# EAGLE design ZED-F9P GNSS FeatherWing (EAGLE 9.4.1)
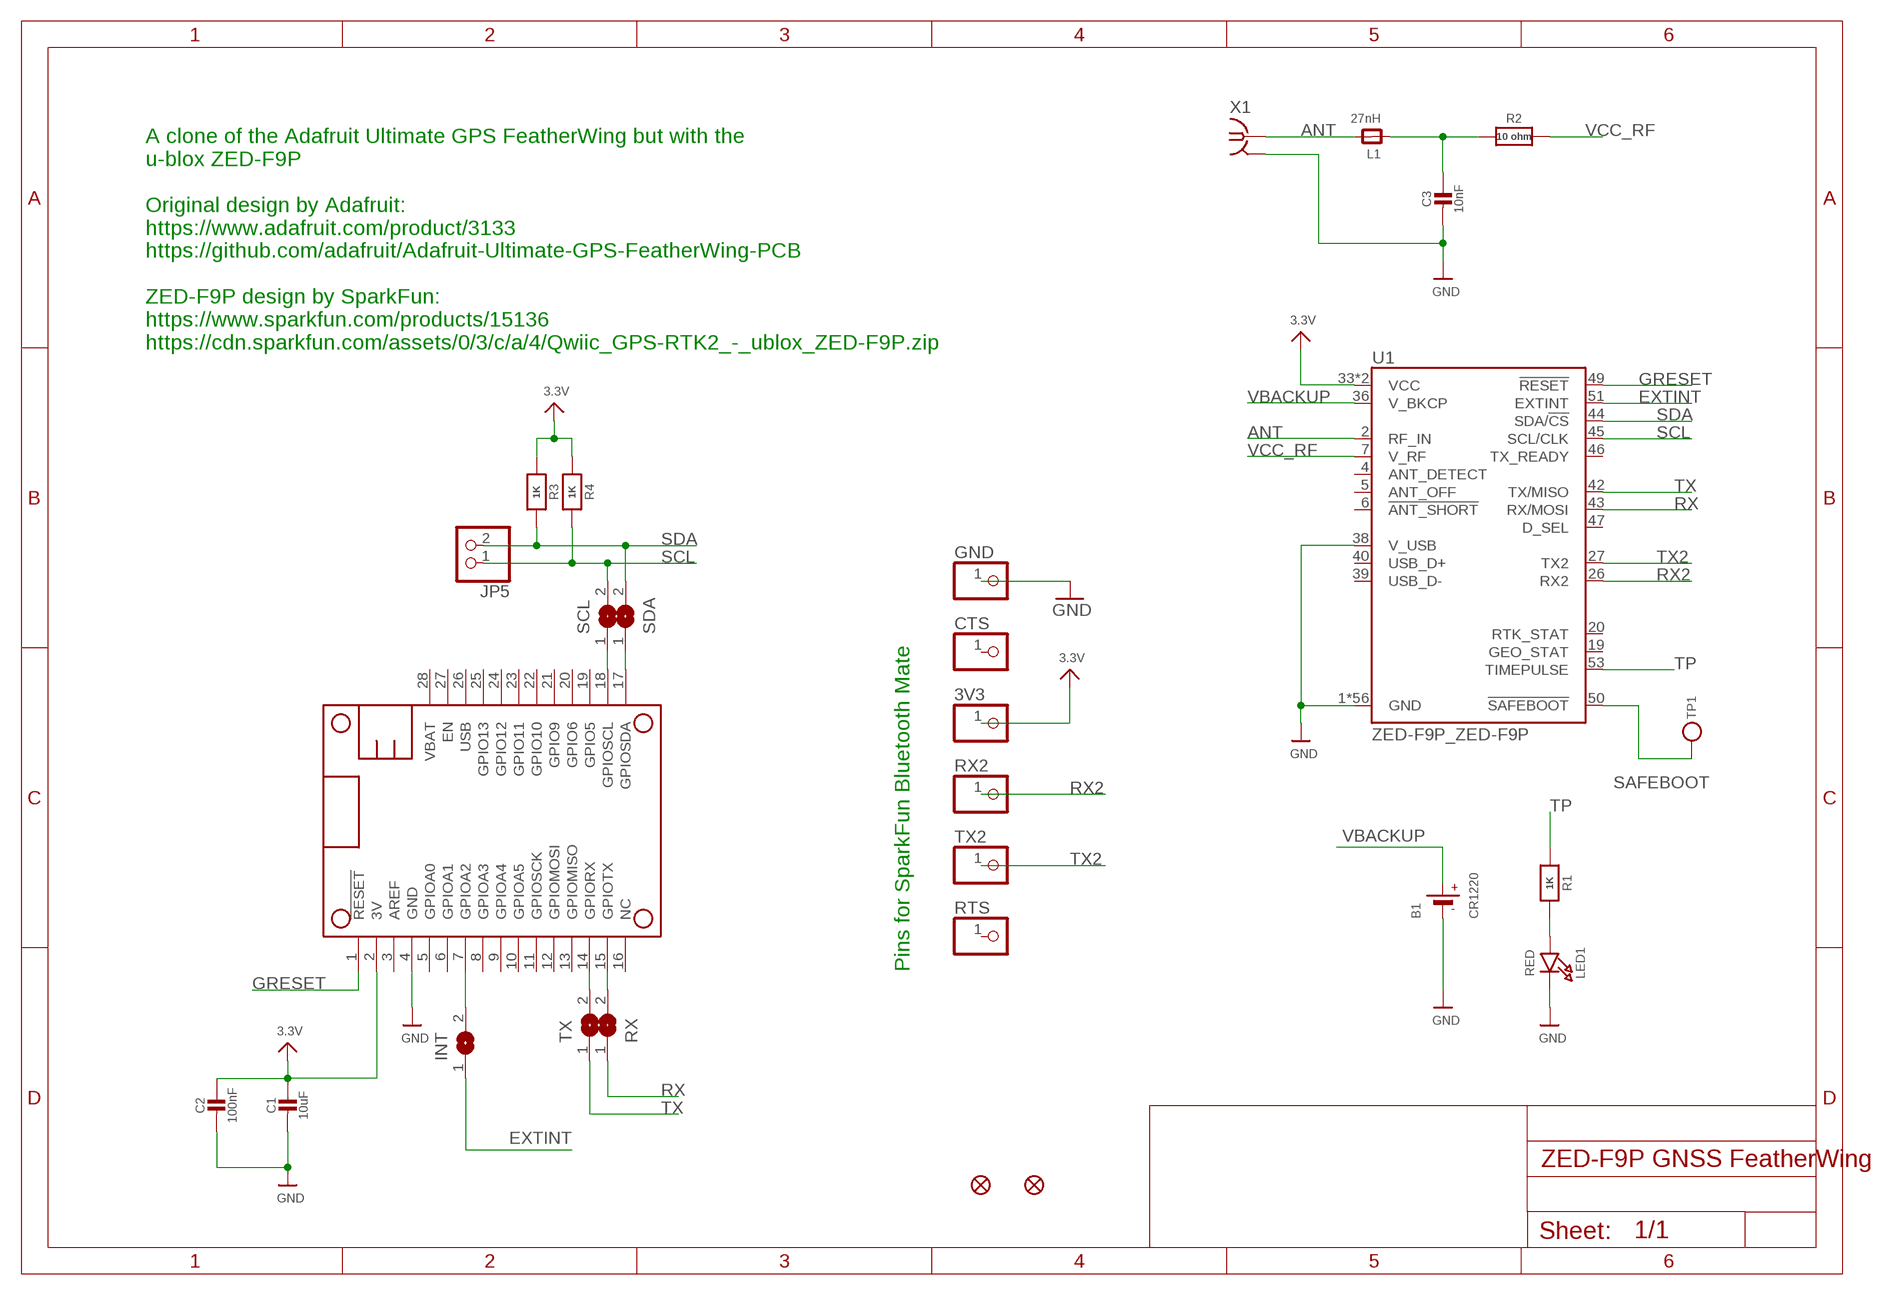
[diagram p0: schematic, sheet 1]

## Parts
3V3  PINHD-1X1  [1X01]
B1  CR1220  BATTERYCR1220_2  [CR1220-2]
C1  10uF  CAP_CERAMIC0805-NOOUTLINE  [0805-NO]
C2  100nF  CAP_CERAMIC0805-NOOUTLINE  [0805-NO]
C3  10nF  CAP_CERAMIC0805-NOOUTLINE  [0805-NO]
CTS  PINHD-1X1  [1X01]
FID1  FIDUCIAL""  [FIDUCIAL_1MM]
FID2  FIDUCIAL""  [FIDUCIAL_1MM]
GND  PINHD-1X1  [1X01]
INT  SOLDERJUMPERCLOSED  [SOLDERJUMPER_CLOSEDWIRE]
JP5  HEADER-1X2ROUND  [1X02_ROUND]
L1  27nH  FERRITE-0805NO  [0805-NO]
LED1  RED  LED0805_NOOUTLINE  [CHIPLED_0805_NOOUTLINE]
MS1  MICROBUILDER_FEATHERWINGMICROBUILDER_FEATHERWING_HOLES  [MICROBUILDER_FEATHERWING_HOLES]
R1  1K  RESISTOR_0603_NOOUT  [0603-NO]
R2  10 ohm  RESISTOR0805_NOOUTLINE  [0805-NO]
R3  1K  RESISTOR_0603_NOOUT  [0603-NO]
R4  1K  RESISTOR_0603_NOOUT  [0603-NO]
RTS  PINHD-1X1  [1X01]
RX  SOLDERJUMPERCLOSED  [SOLDERJUMPER_CLOSEDWIRE]
RX2  PINHD-1X1  [1X01]
SCL  SOLDERJUMPERCLOSED  [SOLDERJUMPER_CLOSEDWIRE]
SDA  SOLDERJUMPERCLOSED  [SOLDERJUMPER_CLOSEDWIRE]
TP1  TESTPOINTROUND1.5MM  [TESTPOINT_ROUND_1.5MM]
TX  SOLDERJUMPERCLOSED  [SOLDERJUMPER_CLOSEDWIRE]
TX2  PINHD-1X1  [1X01]
U1  ZED-F9P_ZED-F9P  [ZED-F9P_ZED-F9P]
X1  SMA-142-0711-821/826  [J502-ND-142-0711-821/826]

## Nets
3.3V: 3V3.1 C1.1 C2.1 MS1.2(3V) R3.1 R4.1 U1.33(VCC) U1.34(VCC)
ANT: L1.2 U1.2(RF_IN) X1.1
EXTINT: INT.1 U1.51(EXTINT)
GND: B1.- C1.2 C2.2 C3.2 GND.1 LED1.C MS1.4(GND) U1.1(GND) U1.3(GND) U1.12(GND) U1.14(GND) U1.32(GND) U1.37(GND) U1.38(V_USB) U1.41(GND) U1.48(GND) U1.55(GND) U1.56(GND) U1.57(GND) U1.58(GND) U1.59(GND) U1.60(GND) U1.61(GND) U1.62(GND) U1.63(GND) U1.64(GND) U1.65(GND) U1.66(GND) U1.67(GND) U1.68(GND) U1.69(GND) U1.70(GND) U1.71(GND) U1.72(GND) U1.73(GND) U1.74(GND) U1.75(GND) U1.76(GND) U1.77(GND) U1.78(GND) U1.79(GND) U1.80(GND) U1.81(GND) U1.82(GND) U1.83(GND) U1.84(GND) U1.85(GND) U1.86(GND) U1.87(GND) U1.88(GND) U1.89(GND) U1.90(GND) U1.91(GND) U1.92(GND) U1.93(GND) U1.94(GND) U1.95(GND) U1.96(GND) U1.97(GND) U1.98(GND) U1.99(GND) U1.100(GND) U1.101(GND) U1.102(GND) X1.G@1 X1.G@2 X1.G@3 X1.G@4
GRESET: MS1.1(!RESET) U1.49(!RESET!)
N$1: MS1.18(GPIOSCL) SCL.1
N$2: LED1.A R1.2
N$3: MS1.17(GPIOSDA) SDA.1
N$4: C3.1 L1.1 R2.1
N$5: MS1.14(GPIORX) TX.2
N$6: MS1.15(GPIOTX) RX.2
N$7: INT.2 MS1.7(GPIOA2)
RX: RX.1 U1.43(RX/MOSI)
RX2: RX2.1 U1.26(RX2)
SAFEBOOT: TP1.P$1 U1.50(!SAFEBOOT!)
SCL: JP5.1 R4.2 SCL.2 U1.45(SCL/CLK)
SDA: JP5.2 R3.2 SDA.2 U1.44(SDA/!CS!)
TP: R1.1 U1.53(TIMEPULSE)
TX: TX.1 U1.42(TX/MISO)
TX2: TX2.1 U1.27(TX2)
VBACKUP: B1.+ U1.36(V_BKCP)
VCC_RF: R2.2 U1.7(V_RF)
Unconnected: CTS.1 MS1.3(AREF) MS1.5(GPIOA0) MS1.6(GPIOA1) MS1.8(GPIOA3) MS1.9(GPIOA4) MS1.10(GPIOA5) MS1.11(GPIOSCK) MS1.12(GPIOMOSI) MS1.13(GPIOMISO) MS1.16(NC) MS1.19(GPIO5) MS1.20(GPIO6) MS1.21(GPIO9) MS1.22(GPIO10) MS1.23(GPIO11) MS1.24(GPIO12) MS1.25(GPIO13) MS1.26(USB) MS1.27(EN) MS1.28(VBAT) RTS.1 U1.4(ANT_DETECT) U1.5(ANT_OFF) U1.6(!ANT_SHORT!) U1.19(GEO_STAT) U1.20(RTK_STAT) U1.39(USB_D-) U1.40(USB_D+) U1.46(TX_READY) U1.47(D_SEL)

## Notes on the sheet
- A clone of the Adafruit Ultimate GPS FeatherWing but with the
  u-blox ZED-F9P
  
  Original design by Adafruit:
  https://www.adafruit.com/product/3133
  https://github.com/adafruit/Adafruit-Ultimate-GPS-FeatherWing-PCB
  
  ZED-F9P design by SparkFun:
  https://www.sparkfun.com/products/15136
  https://cdn.sparkfun.com/assets/0/3/c/a/4/Qwiic_GPS-RTK2_-_ublox_ZED-F9P.zip
- Pins for SparkFun Bluetooth Mate

## Library data of the parts
3V3 CTS GND RTS RX2 TX2 = adafruit:PINHD-1X1: Pin header 1x1 for 0.1" spacing With round pins
B1 = microbuilder:BATTERY: CR1220 SMT - Digikey: 3001K-ND CD2032 BAT-HLD-001 - Digikey: BAT-HLD-001-ND
C1-C3 = microbuilder:CAP_CERAMIC: Ceramic Capacitors For new designs, use the packages preceded by an '_' character since they are more reliable: The following footprints should be used on most boards: _0402 - Standard footprint for regular board layouts _0603 - Standard footprint for regular board layouts _0805 - Standard footprint for regular board layouts _1206 - Standard footprint for regular board layouts For extremely tight-pitch boards where space is at a premium, the following 'micro-pitch' footprints can be used (smaller pads, no silkscreen outline, etc.): _0402MP - Micro-pitch footprint for very dense/compact boards _0603MP - Micro-pitch footprint for very dense/compact boards _0805MP - Micro-pitch footprint for very dense/compact boards _1206MP - Micro-pitch footprint for very dense/compact boards
FID1 FID2 = microbuilder:FIDUCIAL: Fiducial Alignment Points Various fiducial points for machine vision alignment.; BOM: EXCLUDE
INT RX SCL SDA TX = microbuilder:SOLDERJUMPER: SMD Solder JUMPER Solder the two pads together to create a connection, or remove the solder to break it. REFLOW - Use this footprint for solder paste and reflow ovens. WAVE - Use this footprint for hand-soldering (larger pads). CLOSED - Has a trace between the two pads to ensure it is closed by default. The trace needs to be cut to disable the jumper, and can be closed again by creating a solder bridge between the two pads.
JP5 = microbuilder:HEADER-1X2: PIN HEADER
L1 = microbuilder:FERRITE: Ferrite Bead 0603 MMZ1608B121C - 120 Ohm @ 100MHz, 600mA, 0.15 Ohm DC Resistance - Digikey: 445-2164-1-ND BK1608HW121-T - 120 Ohm, 600mA Ferrite Chip - Digikey: 587-1876-2-ND 0805 HZ0805B272R-10 - 2.7K Ohm @ 100MHz, 200mA, 0.8 Ohm DC Resistance - Digikey: 240-2504-1-ND (see also Murata BLM21BD272SN1L) MMZ2012Y152B - 1.5K Ohm @ 100MHz, 500mA, 0.4 Ohm DC Resistance - Digikey: 445-1560-1-ND - Mainly for high frequency (80-400MHz) MMZ2012R102A - 1K Ohm @ 100MHz, 500mA, 0.3 Ohm DC Resistance - Digikey: 445-1555-2-ND - More general purpose (10-200MHz)
LED1 = microbuilder:LED: LED 0603 - 0603 Surface Mount Package 2mA: Green LED - Low Power (3.9mcd, 2ma, 1.7Vf) - Digikey: 475-2709-2-ND Orange LED - Low Power (9.8mcd, 2ma, 1.8Vf) - Digikey: 475-1194-2-ND Red LED - Low Power (5mcd, 2ma, 1.8Vf) - Digikey: 475-1195-2-ND Yellow LED - Low Power (7mcd, 2ma, 1.8Vf) - Digikey: 475-1196-2-ND 5mA: Blue LED - Low Power (17mcd, 5ma, 2.9Vf) - Digikey: LNJ937W8CRACT-ND 0805 - 0805 Surface Mount Package 2mA: Red LED (8.8mcd, 2mA, 1.8Vf, Clear) - Low Power [Digikey: 475-2510-1-ND] Green LED (5mcd, 2mA, 1.8Vf, Clear) - Low Power [Digikey: 475-2730-1-ND] Yellow LED (11.3mcd, 2mA, 1.8Vf, Clear) - Low Power [Digikey: 475-2555-1-ND] 20mA: Red LED (104mcd, 20mA, Diffused) - LS R976 [Digikey: 475-1278-6-ND] Red LED (12mcd, 20mA, 2.0Vf, Clear) - APT2012EC [Digikey: 754-1128-1-ND] Green LED (15mcd, 20mA, 2.2Vf, Clear) - APT2012GC [Digikey: 754-1131-1-ND] Orange LED (160mcd, 20mA, 2.1Vf, Clear) - APT2012SECK [Digikey: 754-1130-1-ND] 1206 - 1206 Surface Mount Package Green LED (26mcd, 20mA, Diffused) - LG N971 [Digikey: 475-1407-6-ND] Red LED (15mcd, 20mA, Diffused) - LH N974 [Digikey: 475-1416-6-ND] Cree - Cree High-Power Surface Mount LEDs XPEBWT-L1-0000-00D50 - White 111lm 350mA 2.9Vf 6200K 110° XTEAWT-00-0000-00000LEE3 - White 114lm 350mA 2.85Vf 5000K 115° Everlight - Everlight 45-21 Series Surface Mount LEDs 45-21/QK2C-B2832AC2CB2/2T - Warm White 2000mcd 20mA 3.25Vf 3050K 120° 45-21/LK2C-B38452C4CB2/2T - Nuetral White 2000mcd 20mA 3.25Vf 4150K 120° 45-21/LK2C-B50634C6CB2/2T - Cold White 2200mcd 20mA 3.25Vf 5650K 120° PLCC2 Reverse Mount LS T77K-J1L2-1-0-2-R18-Z - Red 11.25mcd 2mA 1.8Vf 630nm 120° LO T77K-L1M2-24-Z - Orange 19.6mcd 2mA 1.8Vf 606nm 120° LY T77K-K2M1-26-Z - Yellow 15.7mcd 2mA 1.8Vf 587nm 120°
MS1 = NEO-M8T GNSS FeatherWing:MICROBUILDER_FEATHERWING
R1-R4 = microbuilder:RESISTOR: Resistors For new designs, use the packages preceded by an '_' character since they are more reliable: The following footprints should be used on most boards: _0402 - Standard footprint for regular board layouts _0603 - Standard footprint for regular board layouts _0805 - Standard footprint for regular board layouts _1206 - Standard footprint for regular board layouts For extremely tight-pitch boards where space is at a premium, the following 'micro-pitch' footprints can be used (smaller pads, no silkscreen outline, etc.): _0402MP - Micro-pitch footprint for very dense/compact boards _0603MP - Micro-pitch footprint for very dense/compact boards _0805MP - Micro-pitch footprint for very dense/compact boards _1206MP - Micro-pitch footprint for very dense/compact boards
TP1 = microbuilder:TESTPOINT: Test Point Various test points for characterisation and PCB testing TESTPOINT_SMT - Compact Surface Mount Test Point [Digikey: 5016KTR-ND]
U1 = Qwiic GPS-RTK2 - ublox ZED-F9P:ZED-F9P_ZED-F9P
X1 = con-coax:SMA-: SMA 50 Ohm End Launch Jack Receptacle - Round Contact Johnson Components Source: www.johnsoncomponents.com .. J502-ND.pdf; MF: JOHNSON COMPONENTS; MPN: 142-0711-821; OC_FARNELL: 1019328; OC_NEWARK: 16F3627

## Board
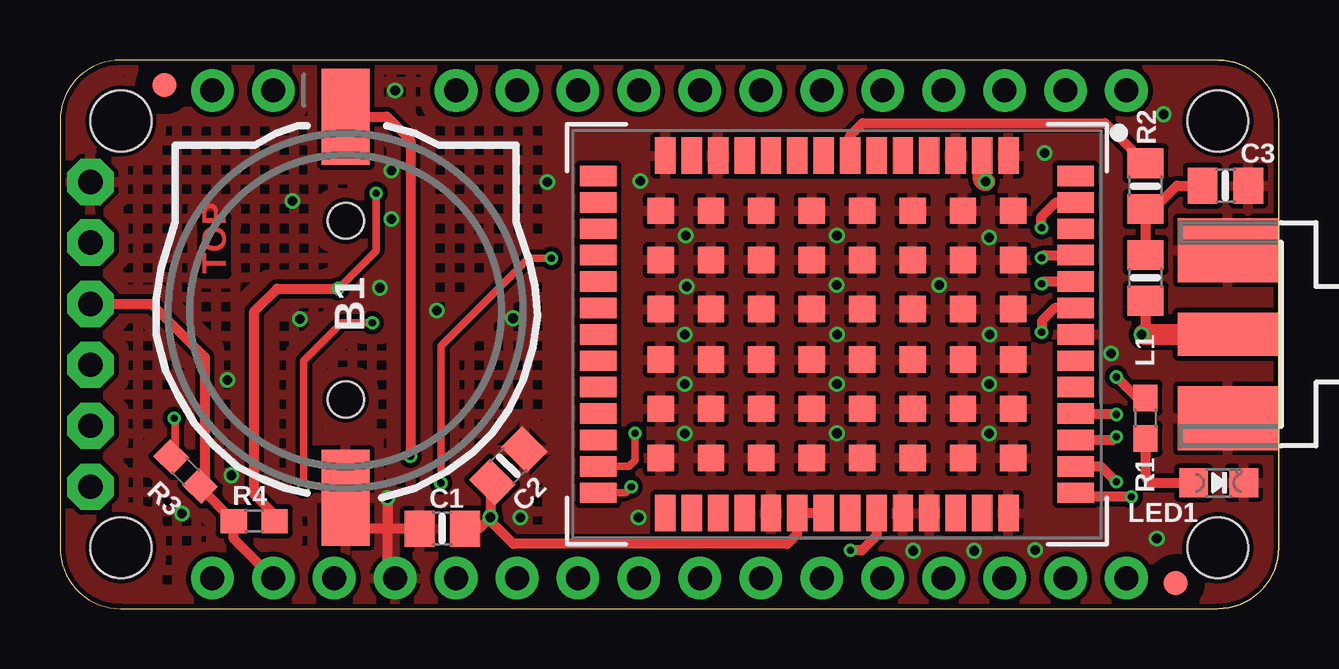
[diagram p1: board, top side]
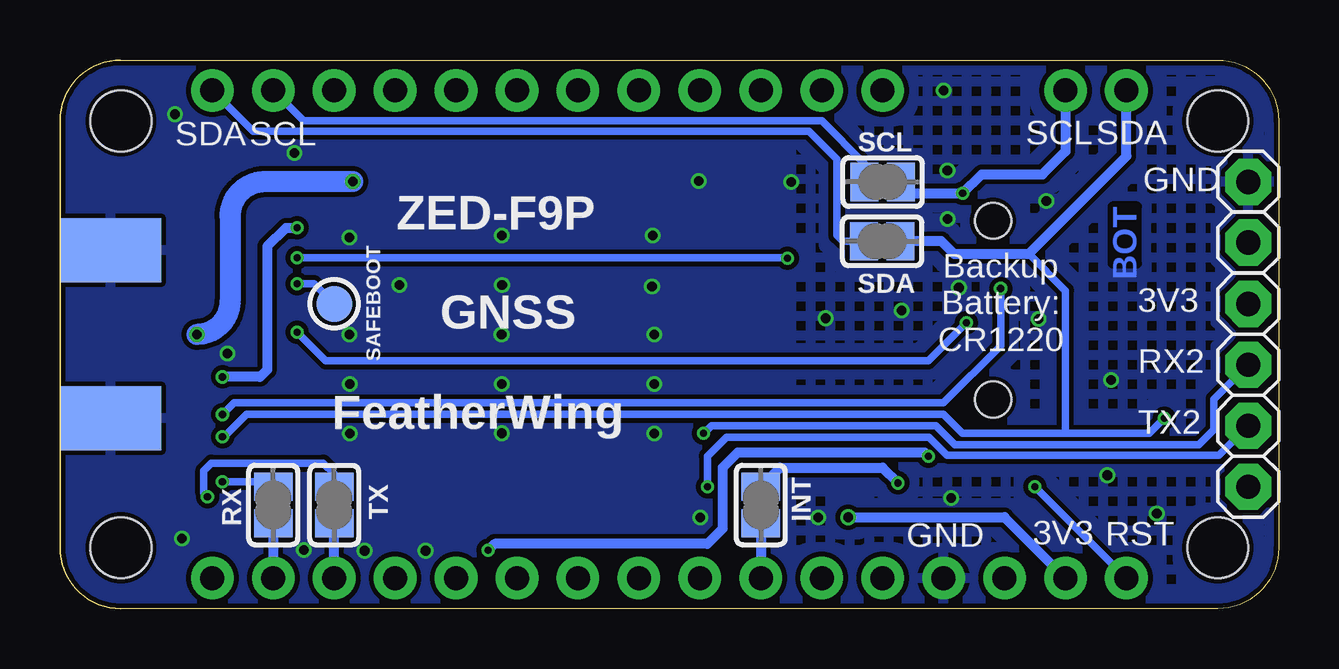
[diagram p2: board, bottom side, seen from below]

Size 50.8 x 22.86 mm. Coordinates in mm from the lower left corner, seen from the top.
Outline: 48.26,22.86 arc-90 50.8,20.32 50.8,2.54 arc-90 48.26,0
Copper layers (1*16): Top 0.018mm / dielectric 1.55mm / Bottom 0.018mm
Design rules "Multi-CB_2L_125um-Tracks_OL35um *": minimum track width 0.125mm, minimum drill 0.2mm, track to track 0.125mm, track to pad 0.125mm, pad to pad 0.125mm, via to via 0.125mm, smd to smd 0mil, copper to edge 0.2mm, drill to drill 0.2mm, minimum pad ring 0.125mm, minimum via ring 0.125mm, stop-mask expansion 2mil, vias tented up to drill 0.45mm, thermal gap 0.2mm

### Footprints (pad centres in the part's own frame; a part is rotated, then mirrored left to right if it is on the bottom)
1X01 = drill 1.016 pad 1.93 octagon: 1 0,0
CR1220-2 = smd 4 x 2: + 8.29,0; - -7.6,0 | hole 1.5: 3.95,0; -3.5,0
0805-NO = smd 1.24 x 1.5: 1 -0.95,0; 2 0.95,0
FIDUCIAL_1MM = smd 1 x 1: 1 0,0
SOLDERJUMPER_CLOSEDWIRE = smd 1.168 x 1.6: 1 -0.762,0; 2 0.762,0 | smd 0.635 x 0.203: WIRE 0,0
1X02_ROUND = drill 1 pad 1.778: 1 -1.27,0; 2 1.27,0
CHIPLED_0805_NOOUTLINE = smd 1.2 x 1.2: A 0,-1.05; C 0,1.05
MICROBUILDER_FEATHERWING_HOLES = drill 1 pad 1.778: 1 6.35,1.27; 2 8.89,1.27; 3 11.43,1.27; 4 13.97,1.27; 5 16.51,1.27; 6 19.05,1.27; 7 21.59,1.27; 8 24.13,1.27; 9 26.67,1.27; 10 29.21,1.27; 11 31.75,1.27; 12 34.29,1.27; 13 36.83,1.27; 14 39.37,1.27; 15 41.91,1.27; 16 44.45,1.27; 17 44.45,21.59; 18 41.91,21.59; 19 39.37,21.59; 20 36.83,21.59; 21 34.29,21.59; 22 31.75,21.59; 23 29.21,21.59; 24 26.67,21.59; 25 24.13,21.59; 26 21.59,21.59; 27 19.05,21.59; 28 16.51,21.59 | hole 2.54: 48.26,20.32; 48.26,2.54; 2.54,20.32; 2.54,2.54
0603-NO = smd 1.1 x 1: 1 -0.85,0; 2 0.85,0
TESTPOINT_ROUND_1.5MM = smd 1.5 x 1.5: P$1 0,0
ZED-F9P_ZED-F9P = smd 0.85 x 1.52: 1 -7.15,-7.45; 2 -6.05,-7.45; 3 -4.95,-7.45; 4 -3.85,-7.45; 5 -2.75,-7.45; 6 -1.65,-7.45; 7 -0.55,-7.45; 8 0.55,-7.45; 9 1.65,-7.45; 10 2.75,-7.45; 11 3.85,-7.45; 12 4.95,-7.45; 13 6.05,-7.45; 14 7.15,-7.45; 28 7.15,7.45; 29 6.05,7.45; 30 4.95,7.45; 31 3.85,7.45; 32 2.75,7.45; 33 1.65,7.45; 34 0.55,7.45; 35 -0.55,7.45; 36 -1.65,7.45; 37 -2.75,7.45; 38 -3.85,7.45; 39 -4.95,7.45; 40 -6.05,7.45; 41 -7.15,7.45 | smd 1.52 x 0.85: 15 9.95,-6.6; 16 9.95,-5.5; 17 9.95,-4.4; 18 9.95,-3.3; 19 9.95,-2.2; 20 9.95,-1.1; 21 9.95,0; 22 9.95,1.1; 23 9.95,2.2; 24 9.95,3.3; 25 9.95,4.4; 26 9.95,5.5; 27 9.95,6.6; 42 -9.95,6.6; 43 -9.95,5.5; 44 -9.95,4.4; 45 -9.95,3.3; 46 -9.95,2.2; 47 -9.95,1.1; 48 -9.95,0; 49 -9.95,-1.1; 50 -9.95,-2.2; 51 -9.95,-3.3; 52 -9.95,-4.4; 53 -9.95,-5.5; 54 -9.95,-6.6 | smd 1.1 x 1.1: 55 -1.05,-1.05; 56 -3.15,-1.05; 57 -5.25,-1.05; 58 -7.35,-1.05; 59 -1.05,-3.1; 60 -3.15,-3.1; 61 -5.25,-3.1; 62 -7.35,-3.1; 63 -1.05,-5.15; 64 -3.15,-5.15; 65 -5.25,-5.15; 66 -7.35,-5.15; 67 -1.05,5.15; 68 -3.15,5.15; 69 -5.25,5.15; 70 -7.35,5.15; 71 -1.05,3.1; 72 -3.15,3.1; 73 -5.25,3.1; 74 -7.35,3.1; 75 -1.05,1.05; 76 -3.15,1.05; 77 -5.25,1.05; 78 -7.35,1.05; 79 1.05,1.05; 80 3.15,1.05; 81 5.25,1.05; 82 7.35,1.05; 83 1.05,3.1; 84 3.15,3.1; 85 5.25,3.1; 86 7.35,3.1; 87 1.05,5.15; 88 3.15,5.15; 89 5.25,5.15; 90 7.35,5.15; 91 1.05,-5.15; 92 3.15,-5.15; 93 5.25,-5.15; 94 7.35,-5.15; 95 1.05,-3.1; 96 3.15,-3.1; 97 5.25,-3.1; 98 7.35,-3.1; 99 1.05,-1.05; 100 3.15,-1.05; 101 5.25,-1.05; 102 7.35,-1.05
J502-ND-142-0711-821/826 = smd 4.191 x 1.778: 1 2.115,0 | smd 4.191 x 2.667: G@1 2.115,3.495; G@2 2.115,-3.495 | smd 4.191 x 2.667 bottom: G@3 2.115,3.495; G@4 2.115,-3.495

### Placement (x,y rotation side)
3V3  1.27,12.7 0 bottom
B1  11.91,12.21 90 top
C1  15.94,3.34 180 top
C2  18.68,5.95 45 top
C3  48.58,17.62 0 top
CTS  1.27,15.26 0 bottom
FID1  4.35,21.81 0 top
FID2  46.51,1.06 0 top
GND  1.27,17.78 0 bottom
INT  21.59,4.32 270 bottom
JP5  7.62,21.59 180 top
L1  45.24,13.78 270 top
LED1  48.3,5.24 270 top
MS1  0,0 0 top
R1  45.24,7.93 270 top
R2  45.24,17.61 90 top
R3  5.24,5.71 135 top
R4  8.1,3.65 0 top
RTS  1.27,5.08 0 bottom
RX  41.91,4.32 270 bottom
RX2  1.27,10.16 0 bottom
SCL  16.51,17.78 0 bottom
SDA  16.53,15.31 0 bottom
TP1  39.37,12.7 0 bottom
TX  39.37,4.32 270 bottom
TX2  1.27,7.62 0 bottom
U1  32.38,11.43 180 top
X1  50.8,11.43 180 top

### Tracks (layer width: path | path; a pad name or v marks a point on that pad's centre or on a via)
3.3V  (via drill 0.4)
  Top 0.406: U1.34 U1.33 30.73,3.11 30.32,2.7 18.89,2.7 17.86,3.73 | 17.86,3.73 v17.94,3.81 17.94,5.21 C2.1 | 17.86,3.73 17.47,3.34 C1.1 | 3V3.1 3.81,12.7 6.03,10.48 6.03,5.11 R3.1 5.84,5.06 R4.1 7.25,2.91 MS1.2
  Bottom 0.406: v17.94,3.81 11.43,3.81 MS1.2
ANT  (via drill 0.4)
  Top 0.406: 45.19,11.43 arc90 v45.09,11.43 45.24,11.59 L1.2
  Top 0.762: U1.2 38.44,17.95 arc90 v38.59,17.79
  Top 0.879: 45.19,11.43 X1.1
  Bottom 0.879: v38.59,17.79 42.26,17.79 arc-90 43.72,16.34 43.72,12.8 arc90 v45.09,11.43
EXTINT  (via drill 0.3)
  Top 0.305: v20.48,14.61 19.53,14.61 15.88,10.95 v15.88,5.24
  Top 0.406: v40.92,14.62 41.02,14.73 U1.51
  Bottom 0.305: v40.92,14.62 20.5,14.62 v20.48,14.61
  Bottom 0.406: INT.1 20.8,5.87 16.51,5.87 v15.88,5.24
GND  (via drill 0.4)
  Top 0.406: C1.2 13.65,3.34 | 13.65,3.34 12.22,3.34 11.91,3.65 B1.- | MS1.4 13.65,1.59 13.65,3.34 | v13.65,4.6 13.65,3.34
  other vias: 5.08,3.97 46.01,20.6 38.72,9.36 32.38,7.31 38.1,2.41 41.03,18.99 32.37,13.48 36.65,13.48 35.56,2.41 26.08,15.55 26.04,7.3 32.38,9.36 26.12,13.43 32.38,15.55 18.89,12.1 26.04,9.36 24.18,17.82 6.99,9.53 45.72,2.92 38.72,7.3 24.12,3.8 20.32,17.78 38.73,15.47 43.81,10.64 13.97,21.59 9.68,16.99 13.81,18.26 19.19,3.8 26.04,11.42 38.74,11.43 32.39,11.43 10,12.06 15.71,12.42 7.14,5.56 13.33,13.37 13.81,16.23 40.64,2.44
  pour Top (isolate 0.203, rank 2, hatched): 0,22.86 0,0 50.8,0 50.8,22.86
  pour Bottom (isolate 0.203, rank 2, hatched): 0,22.86 0,0 50.8,0 50.8,22.86
  pour Bottom (isolate 0.203): 20.32,22.86 20.32,0 50.8,0 50.8,22.86
  pour Top (isolate 0.203): 20.32,22.86 20.32,0 50.8,0 50.8,22.86
GRESET  (via drill 0.3)
  Top 0.305: v10.16,5.08 10.16,10.32 11.75,11.91 v13.02,11.91
  Top 0.406: v40.92,11.51 40.94,11.53 40.94,11.99 41.48,12.53 U1.49
  Bottom 0.305: v40.92,11.51 39.72,10.32 14.61,10.32 v13.02,11.91 | v10.16,5.08 MS1.1
N$1
  Bottom 0.305: SCL.1 17.27,18.54 19.05,20.32 40.64,20.32 MS1.18
N$2
  Top 0.406: R1.2 45.24,5.48 45.48,5.24 LED1.A
N$3
  Bottom 0.305: SDA.1 18.17,15.31 18.41,15.56 18.41,18.73 19.57,19.89 42.75,19.89 MS1.17
N$4
  Top 0.406: L1.1 R2.1 45.59,16.66 46.56,17.62 C3.1
N$5
  Bottom 0.406: MS1.14 TX.2
N$6
  Bottom 0.406: RX.2 MS1.15
N$7
  Bottom 0.406: INT.2 MS1.7
RX  (via drill 0.3)
  Top 0.406: U1.43 43.38,5.93 v44.03,5.29
  Bottom 0.305: RX.1 42.12,5.29 v44.03,5.29
RX2  (via drill 0.3)
  Top 0.305: U1.26 23.71,5.93 23.97,6.19 v23.97,7.3
  Bottom 0.305: v23.97,7.3 23.65,7.62 14.29,7.62 13.49,6.83 3.33,6.83 2.7,7.46 2.7,8.73 RX2.1
SAFEBOOT  (via drill 0.3)
  Top 0.406: U1.50 41.01,13.63 v40.92,13.54
  Bottom 0.305: TP1.P$1 40.21,13.54 v40.92,13.54
SCL  (via drill 0.3)
  Top 0.305: v13.18,17.3 13.18,14.92 v11.59,13.34
  Top 0.406: U1.45 43.99,8.13 v44.03,8.09 | R4.2 8.95,3.91 8.1,4.76 8.1,12.38 9.05,13.34 v11.59,13.34
  Bottom 0.305: v44.03,8.09 43.55,8.57 13.97,8.57 11.59,10.95 v11.59,13.34
  Bottom 0.406: JP5.1 8.89,19.05 9.84,18.1 12.38,18.1 v13.18,17.3 15.27,17.3 SCL.2
SDA  (via drill 0.3)
  Top 0.305: R3.2 4.8,6.47 4.8,7.9 v4.76,7.94
  Top 0.406: U1.44 43.9,7.03 v44.03,7.16
  Bottom 0.305: v44.03,7.16 43.96,7.16 43.02,8.1 13.97,8.1 13.18,7.3 8.89,7.3 | v4.76,7.94 5.4,7.3 8.89,7.3 | 10.42,14.78 8.89,13.25 8.89,7.3
  Bottom 0.406: JP5.2 6.35,18.85 10.42,14.78 13.54,14.78 14.06,15.31 SDA.2
TP  (via drill 0.3)
  Top 0.406: v44.03,9.65 44.9,8.78 R1.1 | v40.92,15.87 40.92,16.34 41.51,16.93 U1.53
  Bottom 0.406: v40.92,15.87 41.38,15.87 42.16,15.09 42.16,9.96 42.46,9.65 v44.03,9.65
TX  (via drill 0.3)
  Top 0.406: U1.42 42.49,4.67 44.64,4.67 v44.65,4.66
  Bottom 0.305: v44.65,4.66 44.8,4.82 44.8,5.75 44.49,6.06 39.82,6.06 39.37,5.61 TX.1
TX2  (via drill 0.3)
  Top 0.305: U1.27 23.56,4.83 v23.81,5.08
  Bottom 0.305: v23.81,5.08 23.81,6.35 23.02,7.14 14.58,7.14 13.83,6.4 2.49,6.4 TX2.1
VBACKUP  (via drill 0.3)
  Top 0.406: U1.36 34.03,3.04 33.43,2.43 v32.95,2.43 | B1.+ 13.63,20.5 14.61,19.53 v14.61,6.35
  Bottom 0.406: v32.95,2.43 32.68,2.7 23.81,2.7 23.18,3.33 23.18,5.87 22.54,6.51 14.76,6.51 v14.61,6.35
VCC_RF
  Top 0.406: U1.7 32.94,19.71 33.45,20.23 43.57,20.23 R2.2

### Text on the board
Top: TOP
Bottom: BOT
bPlace: SDA | SCL | SCL | SDA | ZED-F9P | Backup / Battery: / CR1220 | GNSS | SAFEBOOT | FeatherWing | RST | 3V3 | GND